# EAGLE design GrandPrIEEE (EAGLE 7.7.0)
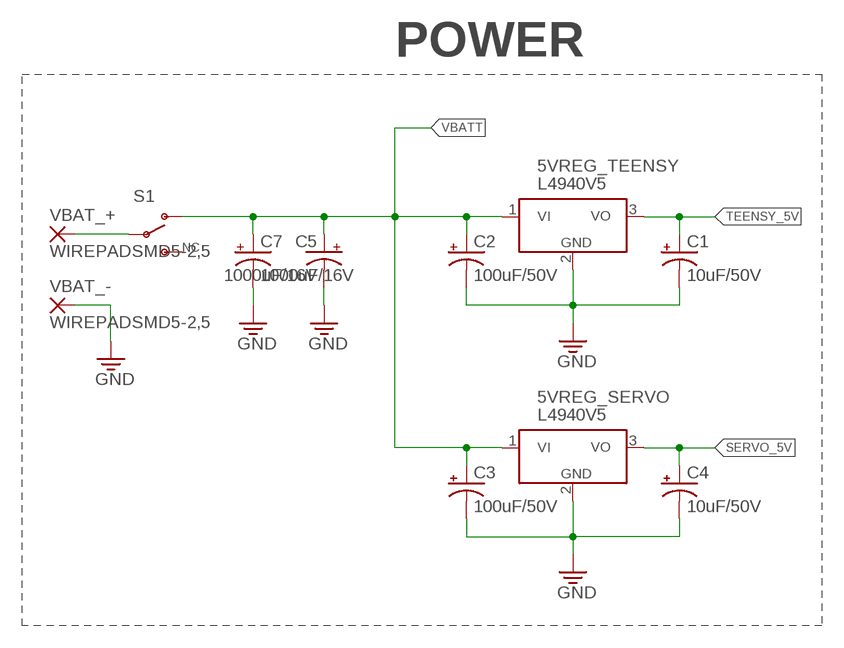
[diagram p0: schematic, sheet 1, part 1 of 2]
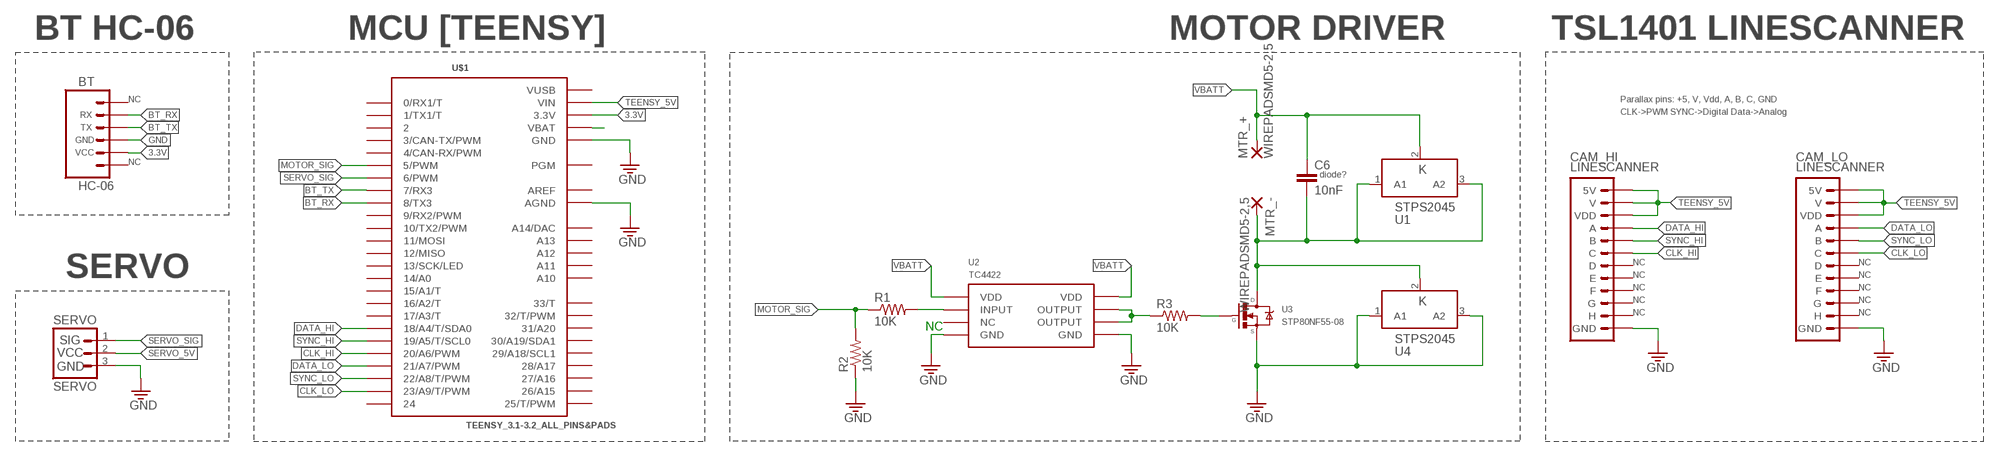
[diagram p1: schematic, sheet 1, part 2 of 2]

## Parts
5VREG_SERVO  L4940V5  L4940V5_HEATSINK  [TO-220-HEATSINK]
5VREG_TEENSY  L4940V5  L4940V5_HEATSINK  [TO-220-HEATSINK]
BT  HC-06  [1X06]
C1  10uF/50V  CPOL-USE2.5-5  [E2,5-5]
C2  100uF/50V  CPOL-USE3.5-8  [E3,5-8]
C3  100uF/50V  CPOL-USE3.5-8  [E3,5-8]
C4  10uF/50V  CPOL-USE2.5-5  [E2,5-5]
C5  1000uF/16V  CPOL-USE5-10.5  [E5-10,5]
C6  10nF  C-EU025-025X050  [C025-025X050]
C7  1000uF/16V  CPOL-USE5-10.5  [E5-10,5]
CAM_HI  LINESCANNER  [LINESCANNER]
CAM_LO  LINESCANNER  [LINESCANNER]
MTR_+  WIREPADSMD5-2,5  [5-2,5]
MTR_-  WIREPADSMD5-2,5  [5-2,5]
R1  10K  R-US_0207/7  [0207/7]
R2  10K  R-US_0207/7  [0207/7]
R3  10K  R-US_0207/7  [0207/7]
S1  SW_MTS-102C4  [MTS-102C4]
SERVO  SERVO  [1X03]
U1  STPS2045  [TO-220]
U2  TC4422  [DIP-8]
U3  STP80NF55-08  [TO-220]
U4  STPS2045  [TO-220]
U$1  TEENSY_3.1-3.2_ALL_PINS&PADS  [TEENSY_3.0-3.2_ALL_PINS_&_PADS]
VBAT_+  WIREPADSMD5-2,5  [5-2,5]
VBAT_-  WIREPADSMD5-2,5  [5-2,5]

## Nets
3.3V: BT.5(VCC) U$1.3.3V U$1.3.3V1(3.3V) U$1.3.3V2(3.3V)
BT_RX: BT.2(RX) U$1.8(8/TX3)
BT_TX: BT.3(TX) U$1.7(7/RX3)
CLK_HI: CAM_HI.6(C) U$1.20/A6(20/A6/PWM)
CLK_LO: CAM_LO.6(C) U$1.23/A9(23/A9/T/PWM)
DATA_HI: CAM_HI.4(A) U$1.18/A4(18/A4/T/SDA0)
DATA_LO: CAM_LO.4(A) U$1.21/A7(21/A7/PWM)
GND: 5VREG_SERVO.2(GND) 5VREG_TEENSY.2(GND) BT.4(GND) C1.- C2.- C3.- C4.- C5.- C7.- CAM_HI.12(GND) CAM_LO.12(GND) R2.1 SERVO.3(GND) U2.4(GND) U2.5(GND) U3.3(S) U4.1(A1) U4.3(A2) U$1.AGND U$1.GND U$1.GND1(GND) U$1.GND2(GND) VBAT_-.1(P)
MOTOR_SIG: R1.1 R2.2 U$1.5(5/PWM)
N$1: S1.P VBAT_+.1(P)
N$2: U$1.VBAT
N$3: R3.1 U2.6(OUTPUT) U2.7(OUTPUT)
N$4: R1.2 U2.2(INPUT)
N$6: R3.2 U3.1(G)
N$100: C6.2 MTR_-.1(P) U1.1(A1) U1.3(A2) U3.2(D) U4.2(K)
SERVO_5V: 5VREG_SERVO.3(VO) C4.+ SERVO.2(VCC)
SERVO_SIG: SERVO.1(SIG) U$1.6(6/PWM)
SYNC_HI: CAM_HI.5(B) U$1.19/A5(19/A5/T/SCL0)
SYNC_LO: CAM_LO.5(B) U$1.22/A8(22/A8/T/PWM)
TEENSY_5V: 5VREG_TEENSY.3(VO) C1.+ CAM_HI.1(5V) CAM_HI.2(V) CAM_HI.3(VDD) CAM_LO.1(5V) CAM_LO.2(V) CAM_LO.3(VDD) U$1.VIN
VBATT: 5VREG_SERVO.1(VI) 5VREG_TEENSY.1(VI) C2.+ C3.+ C5.+ C6.1 C7.+ MTR_+.1(P) S1.T2 U1.2(K) U2.1(VDD) U2.8(VDD)
Unconnected: BT.1(STATE) BT.6(EN) CAM_HI.7(D) CAM_HI.8(E) CAM_HI.9(F) CAM_HI.10(G) CAM_HI.11(H) CAM_LO.7(D) CAM_LO.8(E) CAM_LO.9(F) CAM_LO.10(G) CAM_LO.11(H) S1.T1 U2.3(NC) U$1.0(0/RX1/T) U$1.1(1/TX1/T) U$1.2 U$1.3(3/CAN-TX/PWM) U$1.4(4/CAN-RX/PWM) U$1.9(9/RX2/PWM) U$1.10(10/TX2/PWM) U$1.11(11/MOSI) U$1.12(12/MISO) U$1.13(13/SCK/LED) U$1.14/A0 U$1.15/A1(15/A1/T) U$1.16/A2(16/A2/T) U$1.17/A3(17/A3/T) U$1.24 U$1.25(25/T/PWM) U$1.26(26/A15) U$1.27(27/A16) U$1.28(28/A17) U$1.29(29/A18/SCL1) U$1.30(30/A19/SDA1) U$1.31(31/A20) U$1.32(32/T/PWM) U$1.33(33/T) U$1.A10 U$1.A11 U$1.A12 U$1.A13 U$1.PGM U$1.RESET/DAC(A14/DAC)

## Notes on the sheet
- POWER | BT HC-06 | MCU [TEENSY] | MOTOR DRIVER | TSL1401 LINESCANNER
- NC | Parallax pins: +5, V, Vdd, A, B, C, GND
- CLK->PWM SYNC->Digital Data->Analog
- NC
- NC | diode?
- NC | NC
- SERVO | NC | NC
- NC | NC
- NC | NC
- NC | NC
- NC

## Power pins joined to a net without a drawn wire
AREF: U$1.AREF
VUSB: U$1.VUSB

## Library data of the parts
5VREG_SERVO 5VREG_TEENSY = GP:L4940V5_HEATSINK
BT = GP:HC-06
C1-C5 C7 = resistor:CPOL-US: POLARIZED CAPACITOR, American symbol
C6 = resistor:C-EU: CAPACITOR, European symbol
CAM_HI CAM_LO = GP:LINESCANNER: https://www.parallax.com/sites/default/files/downloads/28317-TSL1401-DB-Manual.pdf https://www.parallax.com/sites/default/files/downloads/28325-Daughterboard-Expander-Documentation.pdf
MTR_+ MTR_- VBAT_+ VBAT_- = wirepad:WIREPAD: Wire PAD connect wire on PCB
R1-R3 = resistor:R-US_: RESISTOR, American symbol
S1 = GP:SW_MTS-102C4
SERVO = GP:SERVO: SERVO (header)
U1 U4 = GP:STPS2045: http://www.st.com/content/ccc/resource/technical/document/datasheet/22/80/12/d3/6a/e4/46/8c/CD00000820.pdf/files/CD00000820.pdf/jcr:content/translations/en.CD00000820.pdf
U2 = GP:TC4422: http://ww1.microchip.com/downloads/en/DeviceDoc/20001420F.pdf
U3 = GP:STP80NF55-08: http://www.st.com/content/ccc/resource/technical/document/datasheet/c7/b6/50/92/48/85/4d/30/CD00187183.pdf/files/CD00187183.pdf/jcr:content/translations/en.CD00187183.pdf
U$1 = Teensy_3_and_LC_Series_Boards_v1.4:TEENSY_3.1-3.2_ALL_PINS&PADS: Footprint for Teensy 3.1 or 3.2 board using all pads and all through-holes. Pads need a 2x7 0.1" SMD header.

## Board
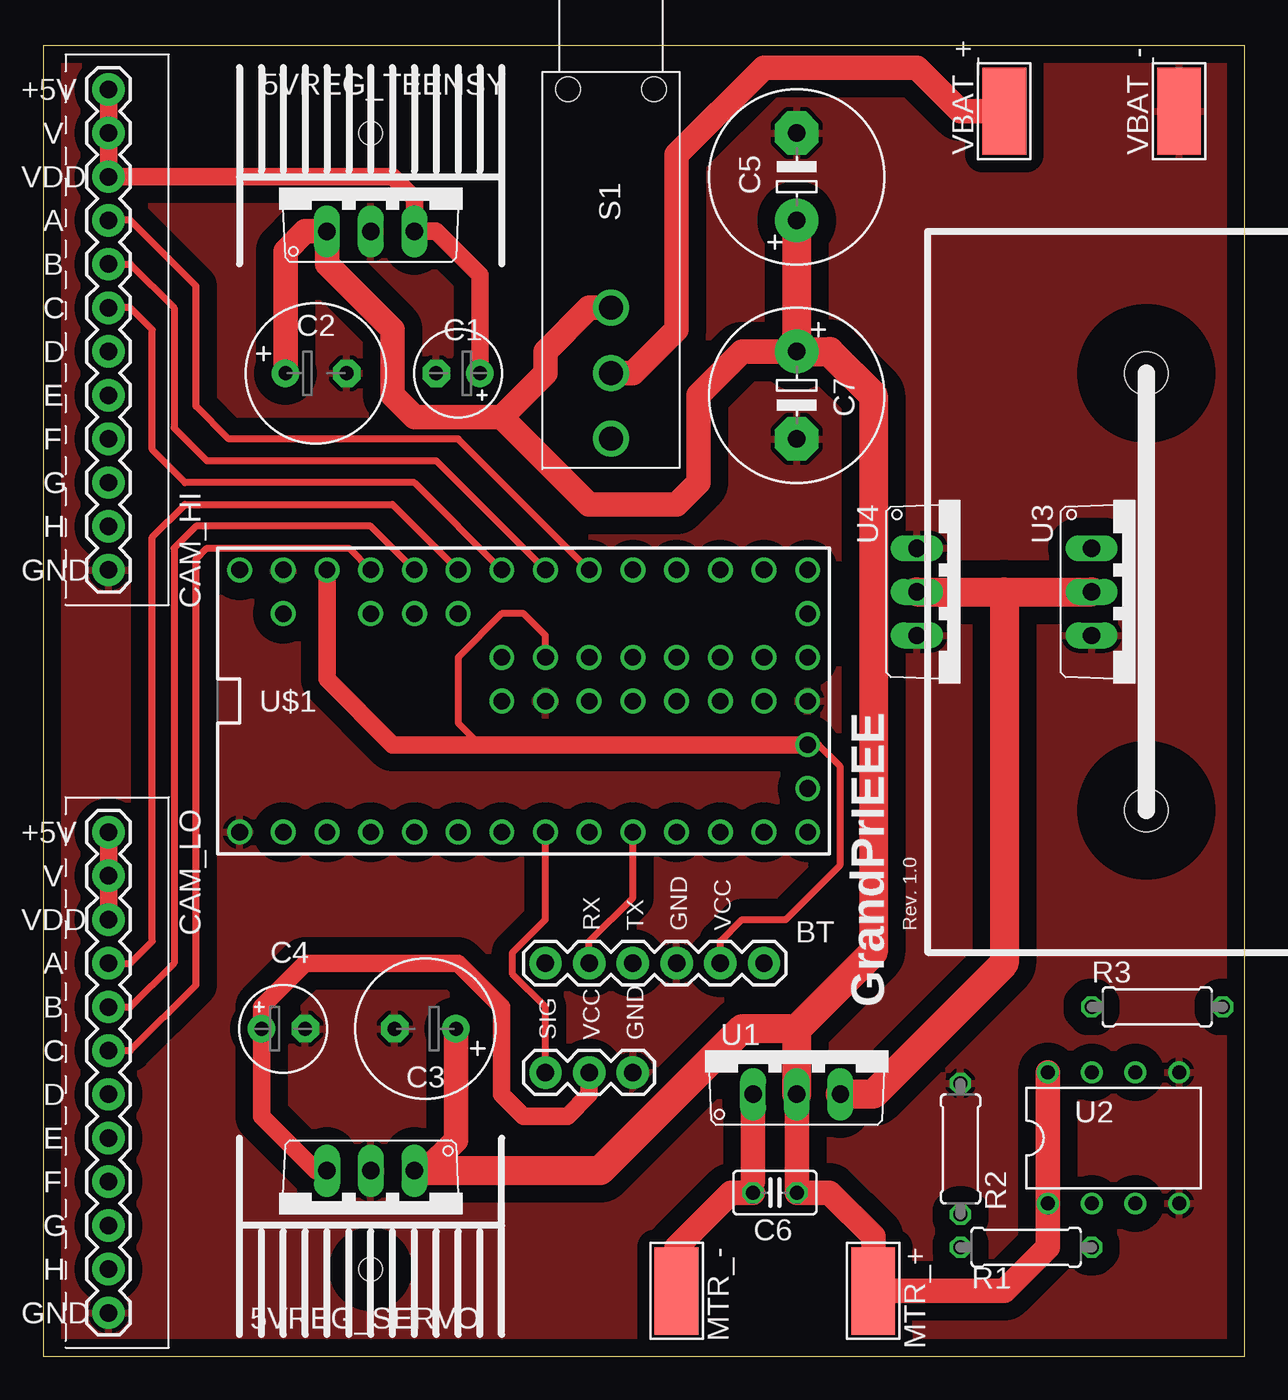
[diagram p2: board, top side]
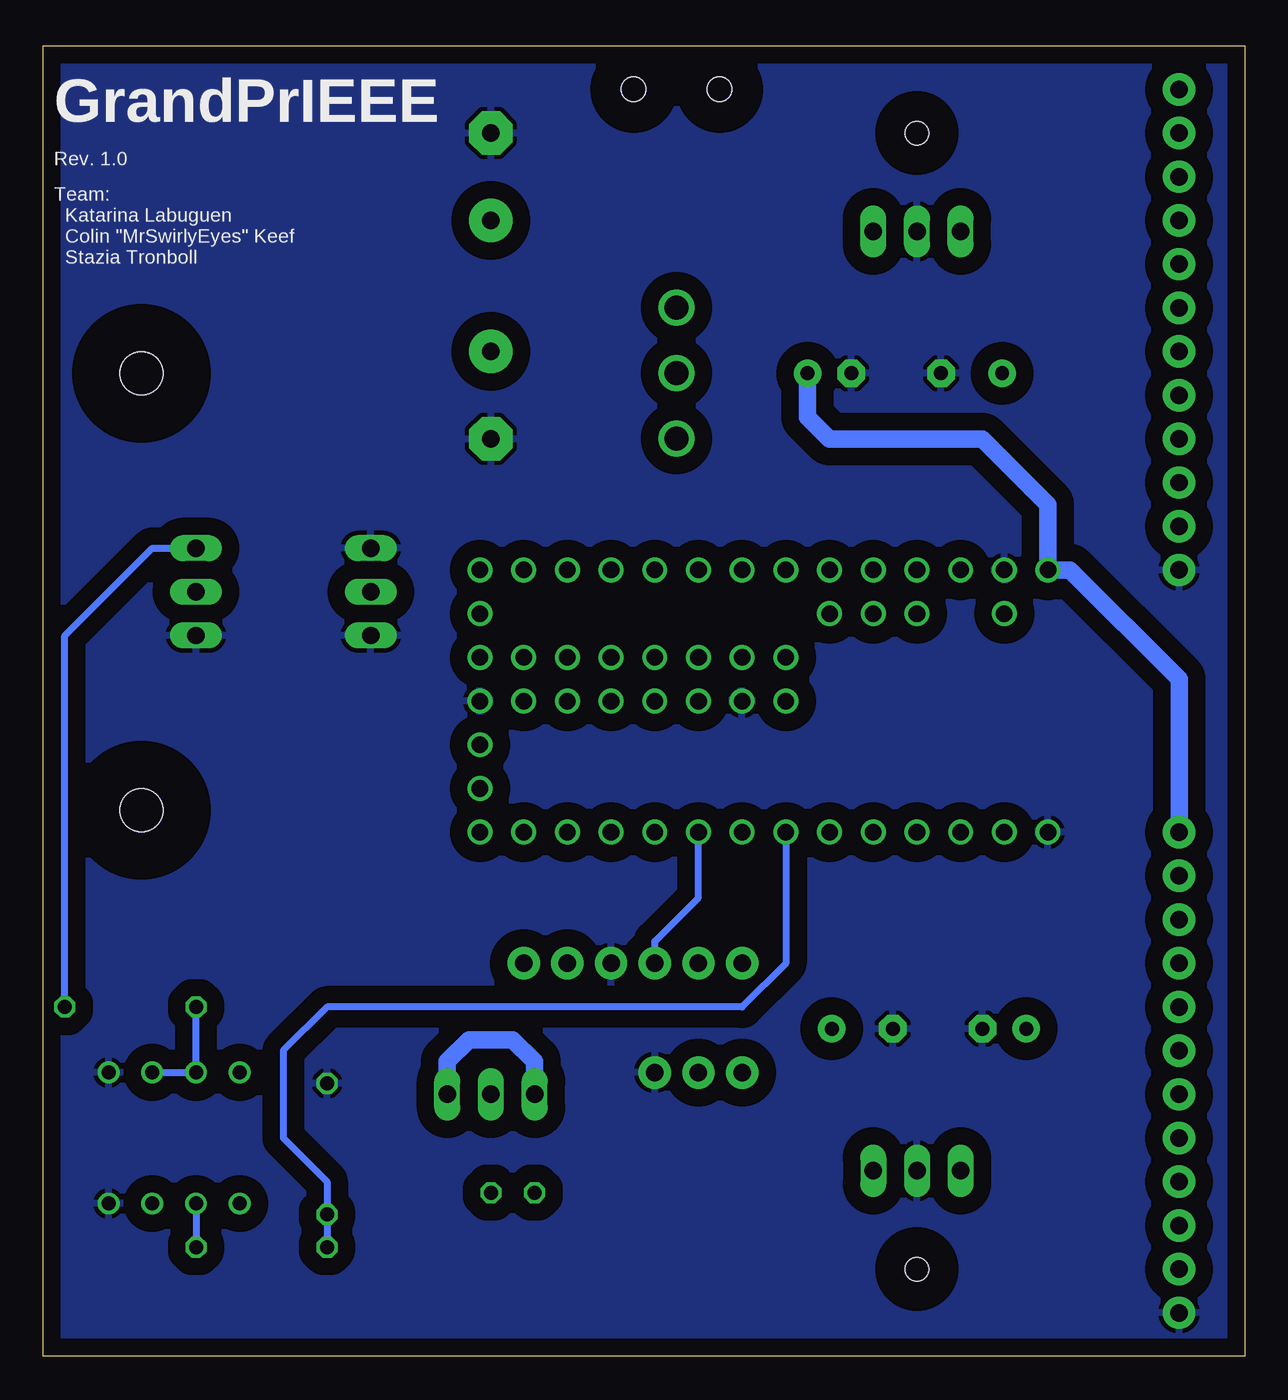
[diagram p3: board, bottom side, seen from below]

Size 69.85 x 76.2 mm. Coordinates in mm from the lower left corner, seen from the top.
Outline: 0,0 69.85,0 69.85,76.2 0,76.2 0,0
Copper layers (1*16): Top 0.0356mm / dielectric 1.5011mm / Bottom 0.0356mm
Design rules "oshpark-2layer": minimum track width 6mil, minimum drill 13mil, track to track 6mil, track to pad 6mil, pad to pad 6mil, via to via 6mil, smd to smd 6mil, copper to edge 15mil, drill to drill 6mil, minimum pad ring 7mil, minimum via ring 7mil, stop-mask expansion 2.5mil, vias tented up to drill 0mil, thermal gap 10mil
Holes 2.5 mm at 64.14,31.75 64.14,57.15
tRestrict: area 61.1,28.8 to 67.1,34.8; area 61.1,54.1 to 67.1,60.1
bRestrict: area 61.1,28.8 to 67.1,34.8; area 61.1,54.1 to 67.1,60.1

### Footprints (pad centres in the part's own frame; a part is rotated, then mirrored left to right if it is on the bottom)
TO-220-HEATSINK = drill 1.016 long: 1 -2.54,0; 2 0,0; 3 2.54,0 | hole 1.35: 0,5.715
1X06 = drill 1.016 pad 1.88: 1 -6.35,0; 2 -3.81,0; 3 -1.27,0; 4 1.27,0; 5 3.81,0; 6 6.35,0
E2,5-5 = drill 0.813 pad 1.6: + -1.27,0 | drill 0.813 pad 1.6 octagon: - 1.27,0
E3,5-8 = drill 0.813 pad 1.6: + -1.778,0 | drill 0.813 pad 1.6 octagon: - 1.778,0
E5-10,5 = drill 1.016 pad 2.54: + -2.54,0 | drill 1.016 pad 2.54 octagon: - 2.54,0
C025-025X050 = drill 0.813 octagon: 1 -1.27,0; 2 1.27,0
LINESCANNER = drill 1.016 pad 1.88: 1 -13.97,0; 2 -11.43,0; 3 -8.89,0; 4 -6.35,0; 5 -3.81,0; 6 -1.27,0; 7 1.27,0; 8 3.81,0; 9 6.35,0; 10 8.89,0; 11 11.43,0; 12 13.97,0
5-2,5 = smd 2.54 x 5.08: 1 0,0
0207/7 = drill 0.813 octagon: 1 -3.81,0; 2 3.81,0
MTS-102C4 = drill 1.4: P 16.5,0; T1 20.3,0; T2 12.7,0 | hole 1.4: 0,2.5; 0,-2.5
1X03 = drill 1.016 pad 1.88: 1 -2.54,0; 2 0,0; 3 2.54,0
TO-220 = drill 1.016 long: 1 -2.54,0; 2 0,0; 3 2.54,0
DIP-8 = drill 0.813 pad 1.27: 1 -3.81,-3.81; 2 -1.27,-3.81; 3 1.27,-3.81; 4 3.81,-3.81; 5 3.81,3.81; 6 1.27,3.81; 7 -1.27,3.81; 8 -3.81,3.81
TEENSY_3.0-3.2_ALL_PINS_&_PADS = drill 0.965: 0 -7.62,13.97; 1 -7.62,11.43; 2 -7.62,8.89; 3 -7.62,6.35; 3.3V 7.62,11.43; 3.3V1 -2.54,-16.51; 3.3V2 2.54,-1.27; 4 -7.62,3.81; 5 -7.62,1.27; 6 -7.62,-1.27; 7 -7.62,-3.81; 8 -7.62,-6.35; 9 -7.62,-8.89; 10 -7.62,-11.43; 11 -7.62,-13.97; 12 -7.62,-16.51; 13 7.62,-16.51; 14/A0 7.62,-13.97; 15/A1 7.62,-11.43; 16/A2 7.62,-8.89; 17/A3 7.62,-6.35; 18/A4 7.62,-3.81; 19/A5 7.62,-1.27; 20/A6 7.62,1.27; 21/A7 7.62,3.81; 22/A8 7.62,6.35; 23/A9 7.62,8.89; 24 0,-3.81; 25 0,-6.35; 26 0,-8.89; 27 0,-11.43; 28 0,-13.97; 29 2.54,-13.97; 30 2.54,-11.43; 31 2.54,-8.89; 32 2.54,-6.35; 33 2.54,-3.81; A10 5.08,6.35; A11 5.08,3.81; A12 0,1.27; A13 2.54,1.27; AGND 7.62,13.97; AREF 5.08,8.89; GND -7.62,16.51; GND1 0,-16.51; GND2 0,-1.27; PGM 2.54,-16.51; RESET/DAC 5.08,-16.51; VBAT -5.08,-16.51; VIN 7.62,16.51; VUSB 5.08,13.97

### Placement (x,y rotation side)
5VREG_SERVO  19.05,10.79 180 top
5VREG_TEENSY  19.05,65.41 0 top
BT  35.56,22.86 0 top
C1  24.13,57.15 180 top
C2  15.88,57.15 0 top
C3  22.23,19.05 180 top
C4  13.97,19.05 0 top
C5  43.81,68.58 90 top
C6  42.55,9.53 180 top
C7  43.81,55.88 270 top
CAM_HI  3.81,59.69 270 top
CAM_LO  3.81,16.51 270 top
MTR_+  48.26,3.81 180 top
MTR_-  36.83,3.81 180 top
R1  57.15,6.35 0 top
R2  53.34,12.06 270 top
R3  64.77,20.32 0 top
S1  33.02,73.66 270 top
SERVO  31.75,16.51 0 top
U1  43.81,15.24 0 top
U2  62.23,12.7 0 top
U3  60.96,44.45 270 top
U4  50.8,44.45 270 top
U$1  27.94,38.1 90 top
VBAT_+  55.88,72.39 0 top
VBAT_-  66.04,72.39 0 top

### Tracks (layer width: path | path; a pad name or v marks a point on that pad's centre or on a via)
3.3V
  Top 0.406: BT.5 39.37,24.13 40.64,25.4 43.18,25.4 46.35,28.57 46.35,34.29 45.09,35.56 U$1.3.3V1 | U$1.3.3V2 29.21,41.91 27.94,43.18 26.67,43.18 24.13,40.64 24.13,36.83 25.4,35.56
  Top 1.016: U$1.3.3V1 25.4,35.56 20.32,35.56 16.51,39.37 U$1.3.3V
BT_RX
  Top 0.406: BT.2 31.75,24.13 34.29,26.67 U$1.8
BT_TX
  Bottom 0.406: BT.3 34.29,24.13 31.75,26.67 U$1.7
CLK_HI
  Top 0.406: CAM_HI.6 5.08,60.96 6.35,59.69 6.35,52.7 8.26,50.8 21.59,50.8 U$1.20/A6
CLK_LO
  Top 0.406: CAM_LO.6 5.08,17.78 8.89,21.59 8.89,46.35 9.53,46.99 17.78,46.99 U$1.23/A9
DATA_HI
  Top 0.406: CAM_HI.4 5.08,66.04 8.89,62.23 8.89,55.24 10.79,53.34 24.13,53.34 U$1.18/A4
DATA_LO
  Top 0.406: CAM_LO.4 5.08,22.86 6.35,24.13 6.35,47.62 8.26,49.53 20.32,49.53 U$1.21/A7
GND
  pour Top (isolate 1.016): 0,0 69.85,0 69.85,76.2 0,76.2
  pour Bottom (isolate 1.016): 69.85,0 0,0 0,76.2 69.85,76.2
MOTOR_SIG
  Bottom 0.406: U$1.5 26.67,22.86 29.21,20.32 53.34,20.32 55.88,17.78 55.88,12.7 53.34,10.16 R2.2 R1.1
N$1
  Top 1.422: VBAT_+.1 53.34,72.39 50.8,74.93 41.91,74.93 36.83,69.85 36.83,59.69 34.3,57.16 S1.P
N$3
  Bottom 0.406: U2.6 U2.7 R3.1
N$4
  Bottom 0.406: U2.2 R1.2
N$6
  Bottom 0.406: R3.2 68.58,41.91 63.5,46.99 U3.1
N$100
  Top 0.406: 41.27,10.16 C6.2
  Top 1.422: U1.1 41.27,10.16 | MTR_-.1 36.83,6.35 40.01,9.53 C6.2
  Top 1.676: U4.2 55.88,44.45 | 55.88,44.45 U3.2 | U1.3 48.26,15.24 55.88,22.86 55.88,44.45
  Bottom 1.016: U1.1 41.27,17.14 42.55,18.41 45.09,18.41 46.35,17.14 U1.3
SERVO_5V
  Top 1.016: 5VREG_SERVO.3 15.88,10.79 12.7,13.97 C4.+ 12.7,20.32 15.24,22.86 24.13,22.86 26.67,20.32 26.67,15.24 27.94,13.97 30.48,13.97 31.75,15.24 SERVO.2
SERVO_SIG
  Top 0.406: SERVO.1 29.21,20.32 27.3,22.23 27.3,23.5 29.21,25.4 U$1.6
SYNC_HI
  Top 0.406: CAM_HI.5 5.08,63.5 7.62,60.96 7.62,53.98 9.53,52.07 22.86,52.07 U$1.19/A5
SYNC_LO
  Top 0.406: CAM_LO.5 5.08,20.32 7.62,22.86 7.62,46.99 8.89,48.26 19.05,48.26 U$1.22/A8
TEENSY_5V
  Top 1.016: C1.+ 25.4,62.87 22.86,65.41 5VREG_TEENSY.3 21.59,67.31 20.32,68.58 CAM_HI.3 CAM_HI.2 CAM_HI.1 | CAM_LO.3 CAM_LO.2 CAM_LO.1
  Bottom 1.016: CAM_LO.1 3.81,39.37 10.16,45.72 U$1.VIN 11.43,49.53 15.24,53.34 24.13,53.34 25.4,54.61 C1.+
VBATT
  Top 1.422: 5VREG_SERVO.1 22.23,10.79 24,12.57 C3.+ | C2.+ 14.1,64.26 15.24,65.41 5VREG_TEENSY.1 16.51,63.5 20.32,59.69 20.32,55.88 21.59,54.61 26.67,54.61 | MTR_+.1 48.26,6.99 45.72,9.53 C6.1 U1.2 | 26.67,54.61 29.21,57.15 29.21,58.42 31.75,60.96 S1.T2 | C7.+ 40.64,58.42 38.1,55.88 38.1,50.8 36.83,49.53 31.75,49.53 26.67,54.61 | U2.8 U2.1 58.42,6.35 55.88,3.81 MTR_+.1 | 48.26,6.35 MTR_+.1
  Top 1.676: C5.+ C7.+ 45.72,58.42 48.26,55.88 48.26,23.5 43.81,19.05 | 22.23,10.79 32.38,10.79 40.64,19.05 43.81,19.05 | U1.2 43.81,19.05

### Text on the board
tPlace: RX | TX | GND | VCC | Rev. 1.0 | GrandPrIEEE | SIG | VCC | GND
bPlace: GrandPrIEEE | Rev. 1.0 | Team: / Katarina Labuguen / Colin "MrSwirlyEyes" Keef / Stazia Tronboll